# EAGLE design NavButtons (EAGLE 7.1.0)
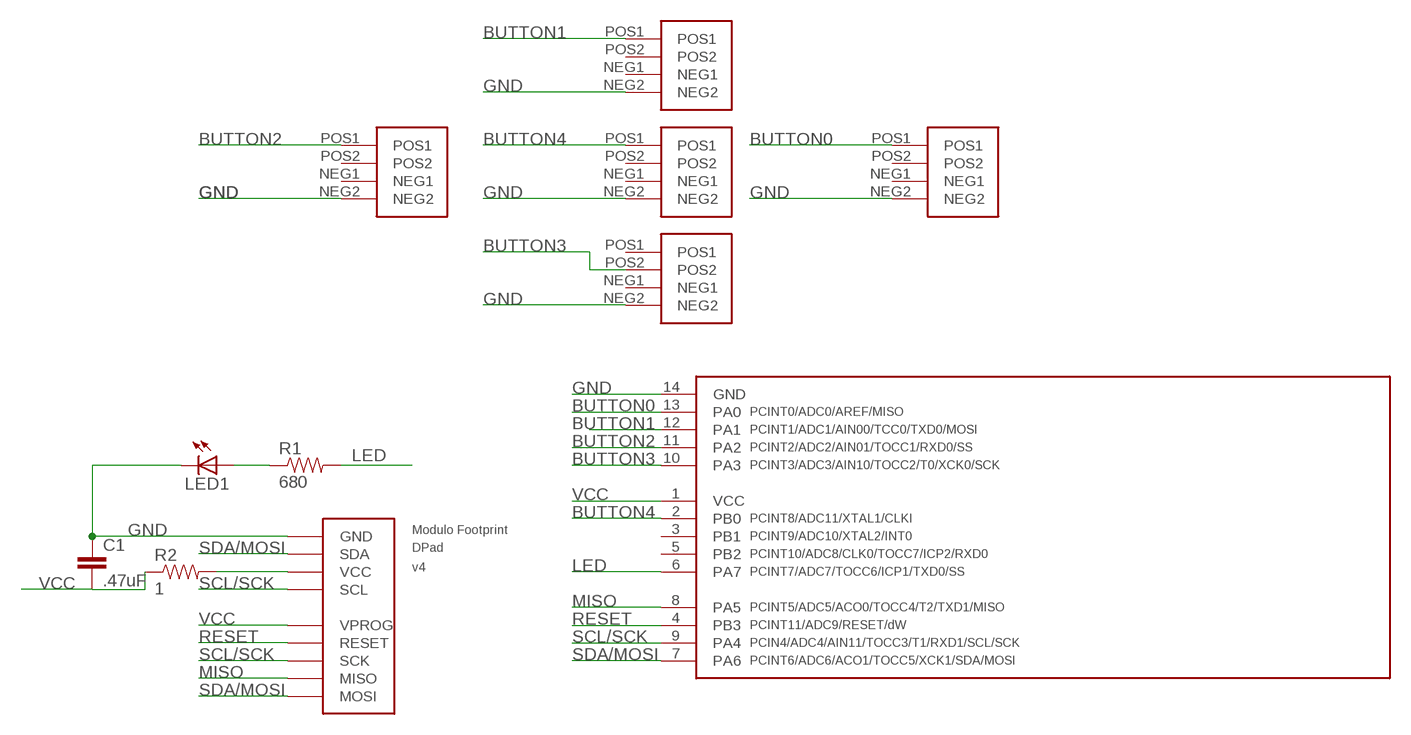
[diagram p0: schematic, sheet 1]

## Parts
B1  TACT-SWITCH  [MJTP1138]
B3  TACT-SWITCH  [MJTP1138]
B4  TACT-SWITCH  [MJTP1138]
B5  TACT-SWITCH  [MJTP1138]
B7  TACT-SWITCH  [MJTP1138]
C1  .47uF  CAP0805  [0805]
LED1  LEDCHIP-LED0805  [CHIP-LED0805]
R1  680  RESISTOR0805-RES  [0805]
R2  1  RESISTOR0805-RES  [0805]
U$1  TINY841  [SOIC14]
U$2  FOOTPRINTFOOTPRINT-2  [FOOTPRINT2]

## Nets
BUTTON0: B5.POS1 U$1.13(PA0)
BUTTON1: B1.POS1 U$1.12(PA1)
BUTTON2: B3.POS1 U$1.11(PA2)
BUTTON3: B7.POS2 U$1.10(PA3)
BUTTON4: B4.POS1 U$1.2(PB0)
GND: B1.NEG2 B3.NEG2 B4.NEG2 B5.NEG2 B7.NEG2 C1.1 LED1.C U$1.14(GND) U$2.BUS0(GND)
LED: R1.2 U$1.6(PA7)
MISO: U$1.8(PA5) U$2.PROG3(MISO)
N$2: R2.2 U$2.BUS2(VCC)
N$8: LED1.A R1.1
RESET: U$1.4(PB3) U$2.PROG1(RESET)
SCL/SCK: U$1.9(PA4) U$2.BUS3(SCL) U$2.PROG2(SCK)
SDA/MOSI: U$1.7(PA6) U$2.BUS1(SDA) U$2.PROG4(MOSI)
VCC: C1.2 R2.1 U$1.1(VCC) U$2.PROG0(VPROG)
Unconnected: B1.NEG1 B1.POS2 B3.NEG1 B3.POS2 B4.NEG1 B4.POS2 B5.NEG1 B5.POS2 B7.NEG1 B7.POS1 U$1.3(PB1) U$1.5(PB2)

## Library data of the parts
B1 B3-B5 B7 = IntegerLabs:TACT-SWITCH
C1 = SparkFun-Capacitors:CAP: Capacitor Standard 0603 ceramic capacitor, and 0.1" leaded capacitor.
LED1 = adafruit:LED: LED OSRAM: - CHIPLED LG R971, LG N971, LY N971, LG Q971, LY Q971, LO R971, LY R971 LH N974, LH R974 LS Q976, LO Q976, LY Q976 LO Q996 - Hyper CHIPLED LW Q18S LB Q993, LB Q99A, LB R99A - SideLED LS A670, LO A670, LY A670, LG A670, LP A670 LB A673, LV A673, LT A673, LW A673 LH A674 LY A675 LS A676, LA A676, LO A676, LY A676, LW A676 LS A679, LY A679, LG A679 - Hyper Micro SIDELED® LS Y876, LA Y876, LO Y876, LY Y876 LT Y87S - SmartLED LW L88C, LW L88S LB L89C, LB L89S, LG L890 LS L89K, LO L89K, LY L89K LS L896, LA L896, LO L896, LY L896 - TOPLED LS T670, LO T670, LY T670, LG T670, LP T670 LSG T670, LSP T670, LSY T670, LOP T670, LYG T670 LG T671, LOG T671, LSG T671 LB T673, LV T673, LT T673, LW T673 LH T674 LS T676, LA T676, LO T676, LY T676, LB T676, LH T676, LSB T676, LW T676 LB T67C, LV T67C, LT T67C, LS T67K, LO T67K, LY T67K, LW E67C LS E67B, LA E67B, LO E67B, LY E67B, LB E67C, LV E67C, LT E67C LW T67C LS T679, LY T679, LG T679 LS T770, LO T770, LY T770, LG T770, LP T770 LB T773, LV T773, LT T773, LW T773 LH T774 LS E675, LA E675, LY E675, LS T675 LS T776, LA T776, LO T776, LY T776, LB T776 LHGB T686 LT T68C, LB T68C - Hyper Mini TOPLED® LB M676 - Mini TOPLED Santana® LG M470 LS M47K, LO M47K, LY M47K Source: http://www.osram.convergy.de/
R1 = SparkFun-Passives:RESISTOR: Resistor Basic schematic elements and footprints for 0603, 1206, and PTH resistors.
R2 = SparkFun-Resistors:RESISTOR: Resistor Basic schematic elements and footprints for 0603, 1206, and PTH resistors.
U$1 = IntegerLabs:TINY841
U$2 = IntegerLabs:FOOTPRINT: Modulo Footprint; BOARD: DPad; VERSION: v4

## Board
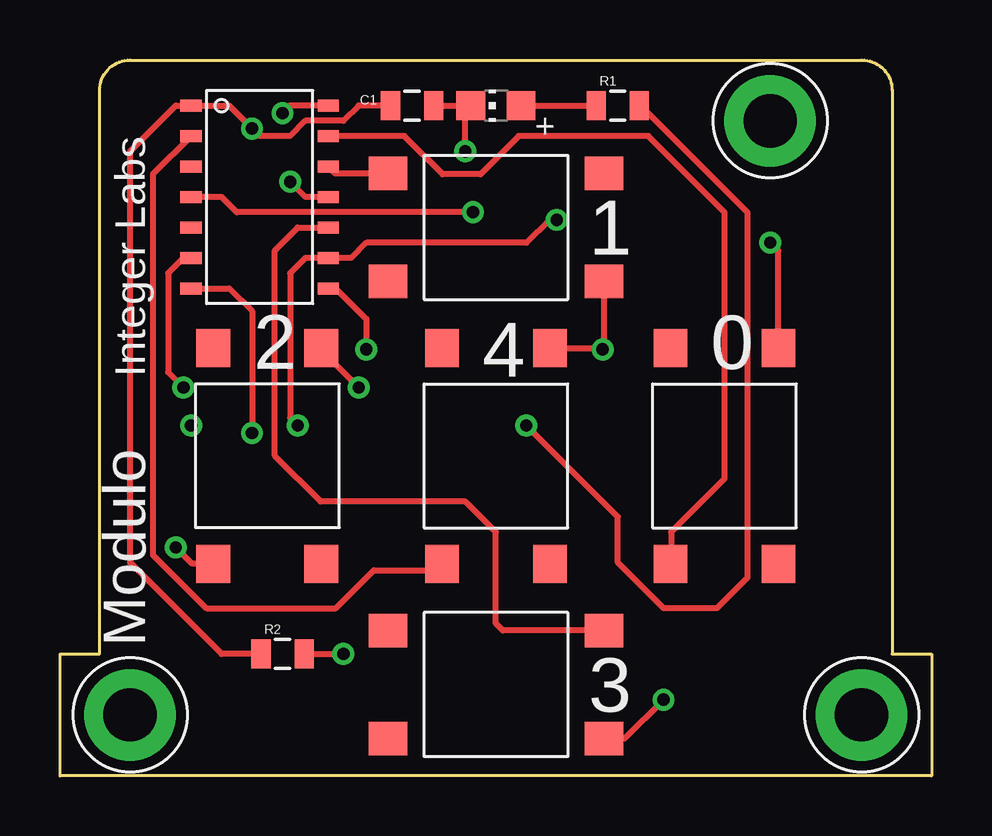
[diagram p1: board, top side]
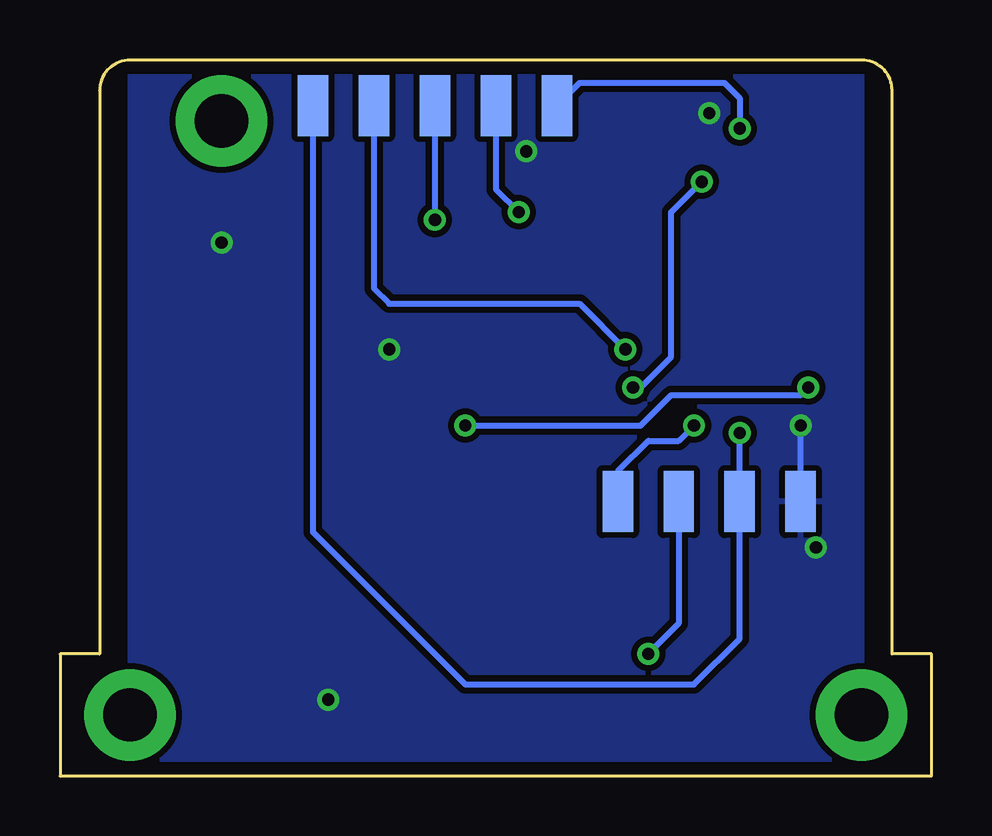
[diagram p2: board, bottom side, seen from below]

Size 36.32 x 29.84 mm. Coordinates in mm from the lower left corner, seen from the top.
Outline: 5.46,0 30.86,0
Copper layers (1*16): Top 0.0178mm / dielectric 59mil / Bottom 0.0178mm
Design rules "SSC-EAGLE-2Lyr_v1.0.0.3 *": minimum track width 6mil, minimum drill 14mil, track to track 6mil, track to pad 6mil, pad to pad 6mil, via to via 6mil, smd to smd 6mil, copper to edge 20mil, drill to drill 16mil, minimum pad ring 8mil, minimum via ring 8mil, stop-mask expansion 3mil, vias tented up to drill 25mil, thermal gap 10mil

### Footprints (pad centres in the part's own frame; a part is rotated, then mirrored left to right if it is on the bottom)
MJTP1138 = smd 1.6 x 1.4: NEG1 -4.5,-2.25; NEG2 4.5,-2.25; POS1 -4.5,2.25; POS2 4.5,2.25
0805 = smd 0.8 x 1.2: 1 -0.9,0; 2 0.9,0
CHIP-LED0805 = smd 1.2 x 1.2: A 0,-1.05; C 0,1.05
SOIC14 = smd 0.508 x 0.889: 1 0,-3.175; 2 1.27,-3.175; 3 2.54,-3.175; 4 3.81,-3.175; 5 5.08,-3.175; 6 6.35,-3.175; 7 7.62,-3.175; 8 7.62,2.54; 9 6.35,2.54; 10 5.08,2.54; 11 3.81,2.54; 12 2.54,2.54; 13 1.27,2.54; 14 0,2.54
FOOTPRINT2 = smd 1.27 x 2.54 bottom: BUS0 5.08,11.43; BUS1 7.62,11.43; BUS2 10.16,11.43; BUS3 12.7,11.43; PROG0 15.24,27.94; PROG1 17.78,27.94; PROG2 20.32,27.94; PROG3 22.86,27.94; PROG4 25.4,27.94 | drill 2.223 pad 3.81: P$1 2.54,2.54; P$2 33.02,2.54; P$3 29.21,27.305

### Placement (x,y rotation side)
B1  18.16,22.86 0 top
B3  8.64,13.34 270 top
B4  18.16,13.34 90 top
B5  27.69,13.34 90 top
B7  18.16,3.81 0 top
C1  14.67,27.94 180 top
LED1  18.16,27.94 90 top
R1  23.24,27.94 0 top
R2  9.27,5.08 0 top
U$1  8.64,27.94 270 top
U$2  0.38,0 0 top

### Tracks (layer width: path | path; a pad name or v marks a point on that pad's centre or on a via)
BUTTON0
  Top 0.254: B5.POS1 25.46,8.86 25.46,10.16 27.69,12.38 27.69,23.5 24.51,26.67 19.11,26.67 17.53,25.08 15.94,25.08 14.35,26.67 U$1.13
BUTTON1
  Top 0.254: B1.POS1 11.47,25.11 U$1.12
BUTTON2  (via drill 0.51)
  Top 0.254: B3.POS1 10.89,17.75 v12.45,16.19 | U$1.11 10.22,24.13 v9.59,24.77
  Bottom 0.254: v12.45,16.19 12.13,16.19 10.86,17.46 10.86,23.5 v9.59,24.77
BUTTON3
  Top 0.254: B7.POS2 18.45,6.06 18.16,6.35 18.16,10.16 16.89,11.43 10.86,11.43 8.95,13.34 8.95,21.91 9.91,22.86 U$1.10
BUTTON4
  Top 0.254: U$1.2 3.87,25.08 3.87,9.21 6.1,6.99 11.49,6.99 13.08,8.57 15.65,8.57 B4.POS1
GND  (via drill 0.51)
  Top 0.254: B5.NEG2 29.94,21.88 v29.59,22.23 | B4.NEG2 22.55,17.84 v22.61,17.78 22.66,17.84 B1.NEG2 | B7.NEG2 23.53,1.56 v25.15,3.17 | B3.NEG2 5.52,8.84 v4.83,9.53 | U$1.14 9.59,27.94 v9.27,27.62 | 15.57,27.99 C1.1 LED1.C 16.89,27.72 v16.89,26.04
  Bottom 0.254: U$2.BUS0 v5.46,14.61
  pour Bottom (isolate 0.254): 2.92,0 2.92,30.48 33.4,30.48 33.4,0
LED  (via drill 0.51)
  Top 0.254: R1.2 24.19,27.94 28.64,23.5 28.64,8.26 27.37,6.99 25.15,6.99 23.24,8.89 23.24,10.79 v19.43,14.61 | U$1.6 5.14,21.59 4.51,20.95 4.51,16.83 v5.14,16.19
  Bottom 0.254: v19.43,14.61 12.13,14.61 10.86,15.88 5.46,15.88 v5.14,16.19
MISO  (via drill 0.51)
  Top 0.254: U$1.8 11.49,20.32 12.76,19.05 v12.76,17.78
  Bottom 0.254: U$2.PROG3 23.24,20.32 22.61,19.68 14.67,19.68 v12.76,17.78
N$2  (via drill 0.51)
  Top 0.254: R2.2 v11.81,5.08
  Bottom 0.254: U$2.BUS2 10.54,6.35 v11.81,5.08
N$8
  Top 0.254: LED1.A R1.1
RESET  (via drill 0.51)
  Top 0.254: v17.21,23.5 7.37,23.5 6.73,24.13 U$1.4
  Bottom 0.254: U$2.PROG1 18.16,24.45 v17.21,23.5
SCL/SCK  (via drill 0.51)
  Top 0.254: v9.91,14.61 9.59,14.92 9.59,20.95 10.22,21.59 U$1.9 12.13,21.59 12.76,22.23 19.43,22.23 20.38,23.18 v20.7,23.18
  Bottom 0.254: U$2.BUS3 13.08,12.7 11.81,13.97 10.54,13.97 v9.91,14.61 | U$2.PROG2 v20.7,23.18
SDA/MOSI  (via drill 0.51)
  Top 0.254: U$1.7 7.05,20.32 8,19.37 v8,14.29
  Bottom 0.254: v8,14.29 U$2.BUS1 8,5.71 9.91,3.81 19.43,3.81 25.78,10.16 U$2.PROG4
VCC  (via drill 0.51)
  Top 0.254: R2.1 6.73,5.08 2.92,8.89 2.92,26.04 4.83,27.94 U$1.1 7.05,27.94 v8,26.99 8.32,26.67 9.59,26.67 10.22,27.3 11.81,27.3 12.45,27.94 C1.2
  Bottom 0.254: U$2.PROG0 14.67,28.89 8.64,28.89 8,28.26 v8,26.99

### Text on the board
tPlace: 1 | 2 | 4 | 0 | 3